# EAGLE schematic Eboard_Powerboard (EAGLE 9.2.2)
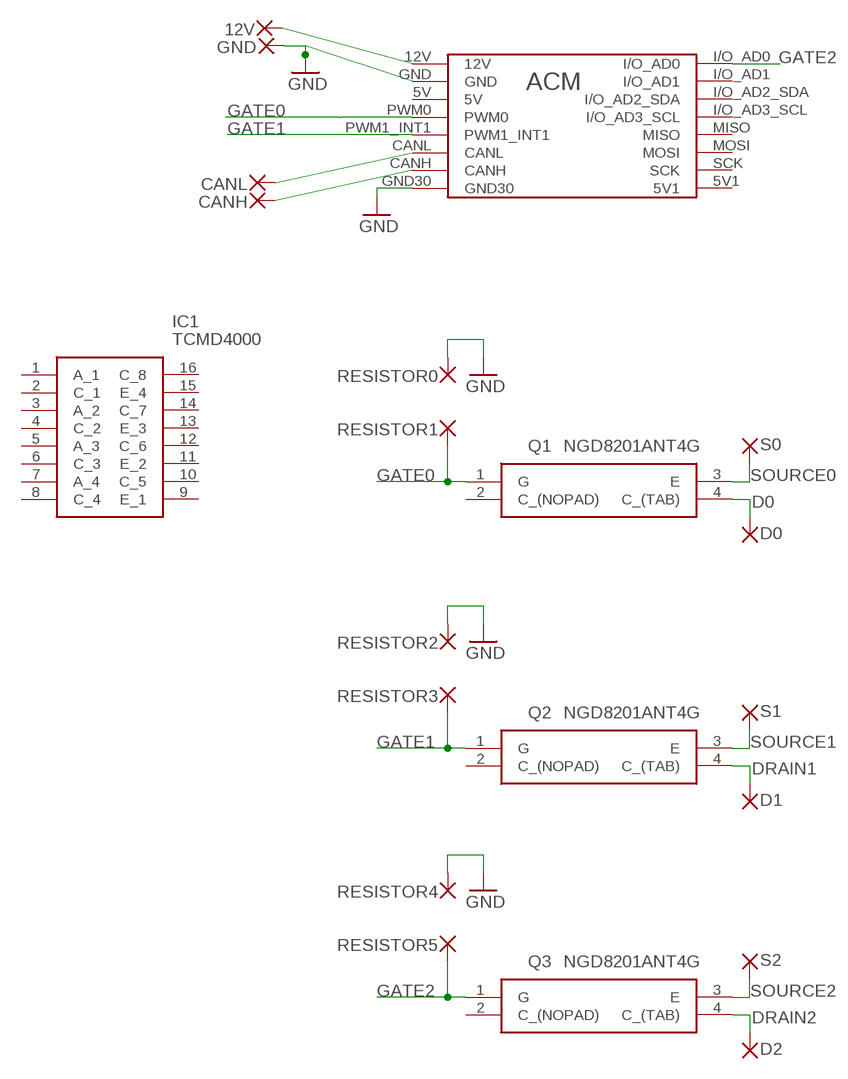
[diagram p0: schematic, sheet 1]

## Parts
12V  2,15/1,0  [2,15/1,0]
CANH  2,15/1,0  [2,15/1,0]
CANL  2,15/1,0  [2,15/1,0]
D0  2,54/1,0  [2,54/1,0]
D1  2,54/1,0  [2,54/1,0]
D2  2,54/1,0  [2,54/1,0]
GND  2,15/1,0  [2,15/1,0]
IC1  TCMD4000  [SOIC127P695X210-16N]
Q1  NGD8201ANT4G  [TO229P990X238-4N]
Q2  NGD8201ANT4G  [TO229P990X238-4N]
Q3  NGD8201ANT4G  [TO229P990X238-4N]
RESISTOR0  2,15/1,0  [2,15/1,0]
RESISTOR1  2,15/1,0  [2,15/1,0]
RESISTOR2  2,15/1,0  [2,15/1,0]
RESISTOR3  2,15/1,0  [2,15/1,0]
RESISTOR4  2,15/1,0  [2,15/1,0]
RESISTOR5  2,15/1,0  [2,15/1,0]
S0  2,54/1,0  [2,54/1,0]
S1  2,54/1,0  [2,54/1,0]
S2  2,54/1,0  [2,54/1,0]
U$1  ACM_CASTELLATED  [ACM_CAS_FP]

## Nets
D0: D0.1(P) Q1.4(C_(TAB))
DRAIN1: D1.1(P) Q2.4(C_(TAB))
DRAIN2: D2.1(P) Q3.4(C_(TAB))
GATE0: Q1.1(G) RESISTOR1.1(P) U$1.PWM0
GATE1: Q2.1(G) RESISTOR3.1(P) U$1.PWM1_INT1
GATE2: Q3.1(G) RESISTOR5.1(P) U$1.I/O_AD0
GND: GND.1(P) RESISTOR0.1(P) RESISTOR2.1(P) RESISTOR4.1(P) U$1.GND U$1.GND30
N$3: 12V.1(P) U$1.12V
N$4: CANL.1(P) U$1.CANL
N$5: CANH.1(P) U$1.CANH
SOURCE0: Q1.3(E) S0.1(P)
SOURCE1: Q2.3(E) S1.1(P)
SOURCE2: Q3.3(E) S2.1(P)
Unconnected: IC1.1(A_1) IC1.2(C_1) IC1.3(A_2) IC1.4(C_2) IC1.5(A_3) IC1.6(C_3) IC1.7(A_4) IC1.8(C_4) IC1.9(E_1) IC1.10(C_5) IC1.11(E_2) IC1.12(C_6) IC1.13(E_3) IC1.14(C_7) IC1.15(E_4) IC1.16(C_8) Q1.2(C_(NOPAD)) Q2.2(C_(NOPAD)) Q3.2(C_(NOPAD)) U$1.5V U$1.5V1 U$1.I/O_AD1 U$1.I/O_AD2_SDA U$1.I/O_AD3_SCL U$1.MISO U$1.MOSI U$1.SCK

## Library data of the parts
12V CANH CANL GND RESISTOR0 RESISTOR1-RESISTOR5 = wirepad:2,15/1,0: THROUGH-HOLE PAD
D0 D1 D2 S0 S1 S2 = wirepad:2,54/1,0: THROUGH-HOLE PAD
IC1 = SFH6916:TCMD4000: Transistor Output Optocouplers Photodarlington Out Quad CTR >600% Source: Datasheet <https://www.vishay.com/docs/83513/tcmd1000.pdf>; DESCRIPTION: Transistor Output Optocouplers Photodarlington Out Quad CTR >600%; HEIGHT: 2.1mm; MANUFACTURER_NAME: Vishay; MANUFACTURER_PART_NUMBER: TCMD4000; MOUSER_PART_NUMBER: 782-TCMD4000; MOUSER_PRICE-STOCK: https://www.mouser.com/Search/Refine.aspx?Keyword=782-TCMD4000
Q1-Q3 = NGD8201ANT4G_Mosfet:NGD8201ANT4G: Source: Datasheet <http://www.onsemi.com/pub/Collateral/NGD8201N-D.PDF>; ALLIED_NUMBER: 70341208; ALLIED_PRICE-STOCK: http://www.alliedelec.com/on-semiconductor-ngd8201ant4g/70341208/; HEIGHT: 2.38mm; MANUFACTURER_NAME: ON Semiconductor; MANUFACTURER_PART_NUMBER: NGD8201ANT4G; MOUSER_PART_NUMBER: 7470901; MOUSER_PRICE-STOCK: http://uk.rs-online.com/web/p/products/7470901; RS_PART_NUMBER: 7470901; RS_PRICE-STOCK: http://uk.rs-online.com/web/p/products/7470901
U$1 = ACM_Castellated:ACM_CASTELLATED